# EAGLE design bpod_stepper_1.4.1 (EAGLE 9.6.2)
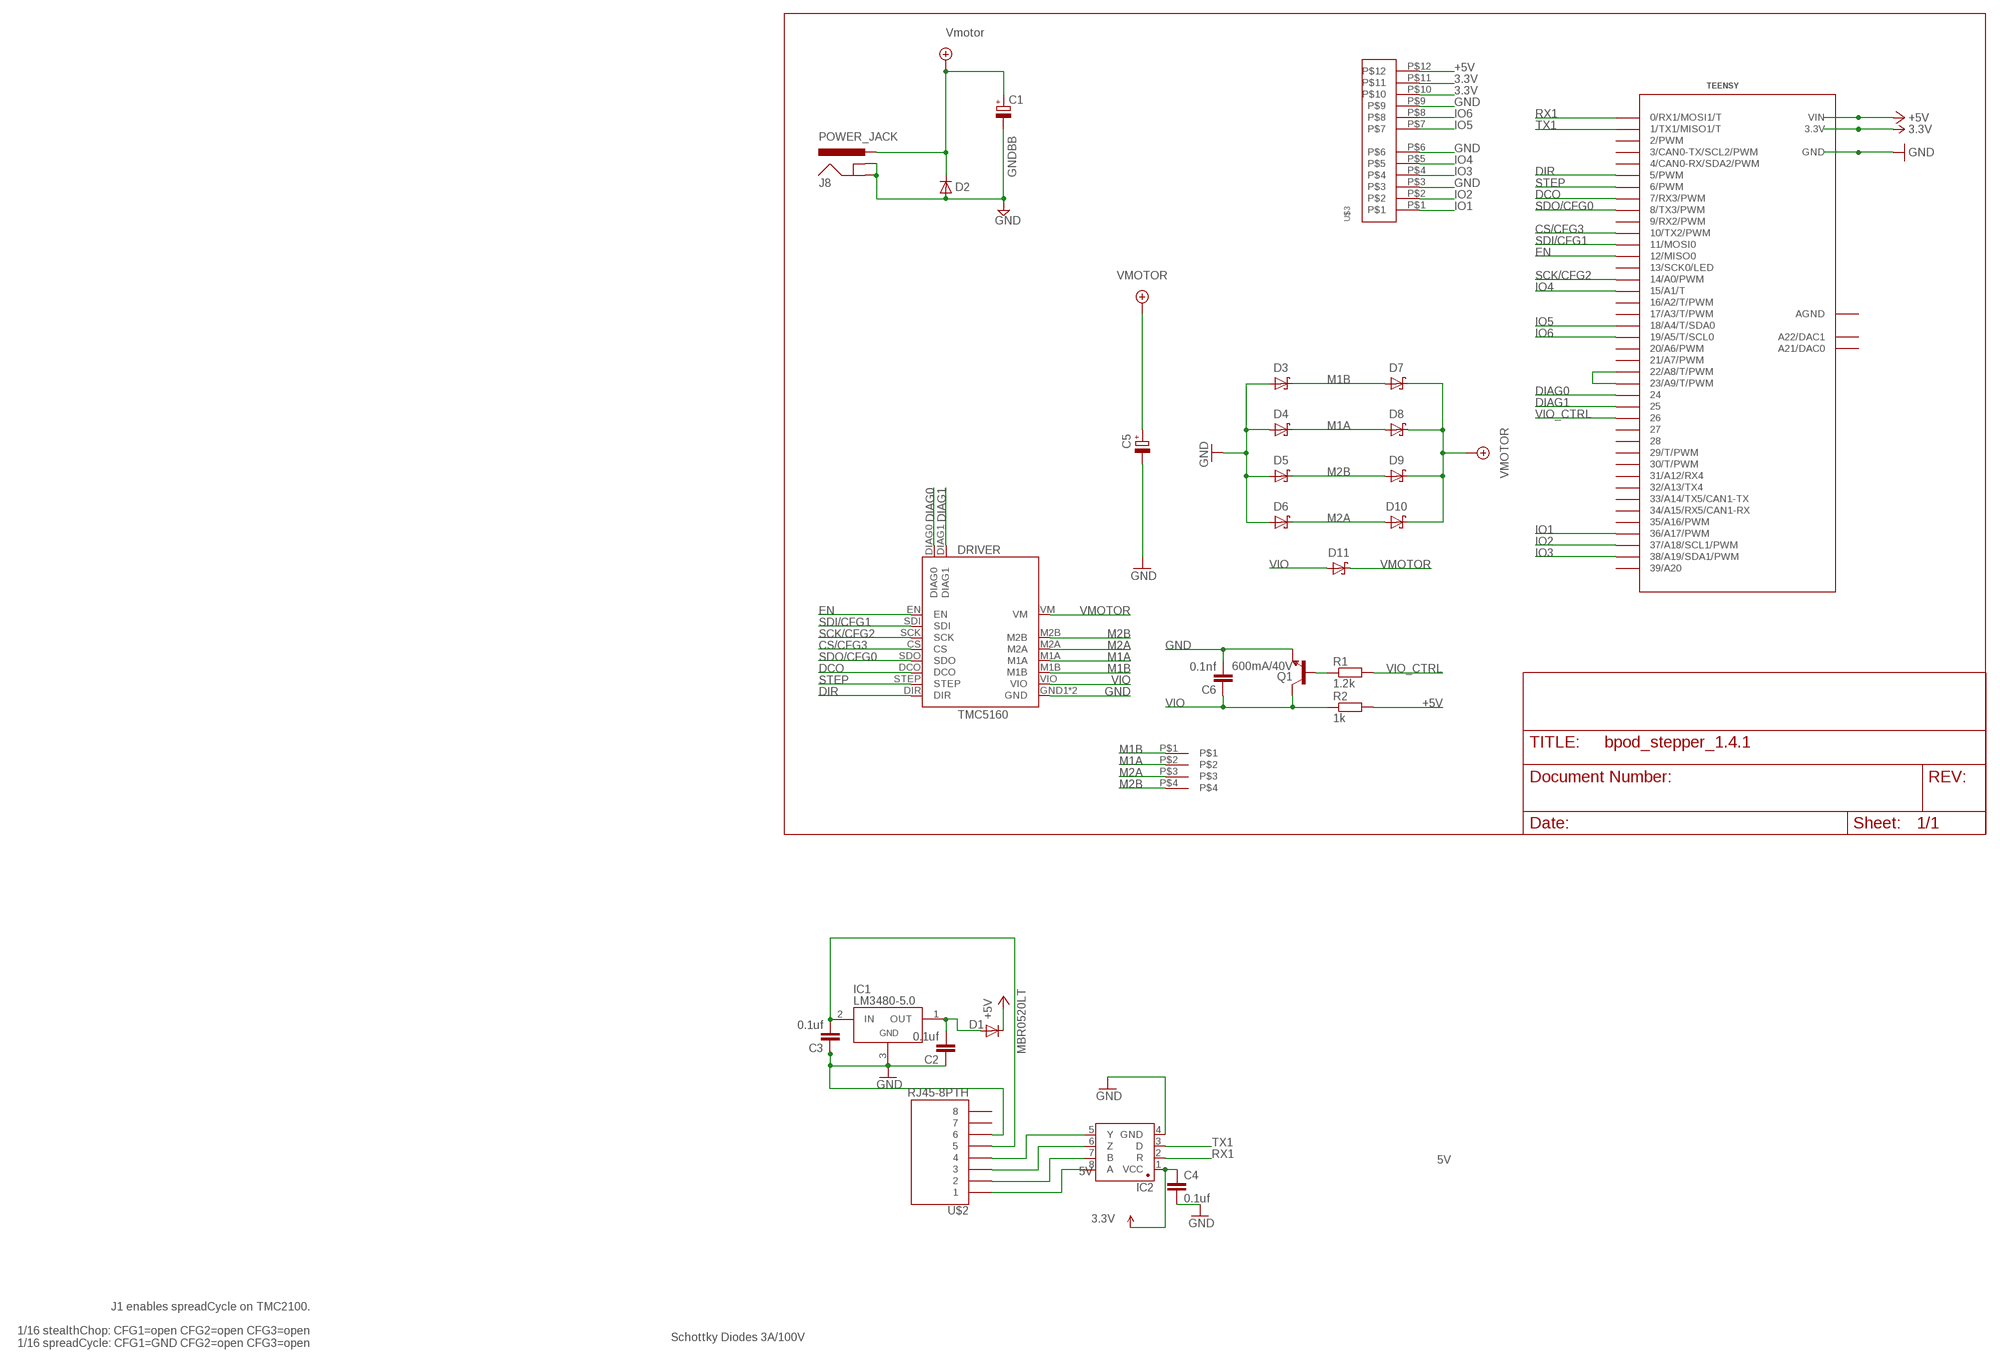
[diagram p0: schematic, sheet 1]

## Parts
C1  CPOL-EUG  [PANASONIC_G]
C2  0.1uf  CAP1206  [1206@1]
C3  0.1uf  CAP1206  [1206@1]
C4  0.1uf  CAP1206  [1206@1]
C5  CPOL-EUG  [PANASONIC_G]
C6  0.1nf  CAP1206  [1206@1]
D1  MBR0520LT  [SOD123]
D2  DIODE-DO214AA  [DO214AA]
D3  S310FA  D_SCHOTTKY-SOD123  [SOD123]
D4  S310FA  D_SCHOTTKY-SOD123  [SOD123]
D5  S310FA  D_SCHOTTKY-SOD123  [SOD123]
D6  S310FA  D_SCHOTTKY-SOD123  [SOD123]
D7  S310FA  D_SCHOTTKY-SOD123  [SOD123]
D8  S310FA  D_SCHOTTKY-SOD123  [SOD123]
D9  S310FA  D_SCHOTTKY-SOD123  [SOD123]
D10  S310FA  D_SCHOTTKY-SOD123  [SOD123]
D11  S310FA  D_SCHOTTKY-SOD123  [SOD123]
DRIVER  TMC5160  [TMC5160]
IC1  LM3480-5.0  [SOT-23-3]
IC2  SN65HVD31DR  [SO08]
J8  POWER_JACK  [POWER_JACK_PTH]
Q1  600mA/40V  TRANS_NPN-MMBT2222AL  [SOT23-3]
R1  1.2k  R-EU_R1206  [R1206]
R2  1k  R-EU_R1206  [R1206]
TEENSY  TEENSY_3.6_DIL  [TEENSY_3.6_DIL]
U$2  RJ45-8PTH  [RJ45-8]
U$3  12POS_MOLEX_SOCKET  [12POS_MOLEX_SOCKET]
U$4  MOLEX395221004  [MOLEX395221004]

## Nets
3.3V: C4.1 IC2.1(VCC) TEENSY.3.3V TEENSY.3.3V3(3.3V) U$3.P$10 U$3.P$11
+5V: D1.C R2.2 TEENSY.VIN U$3.P$12
CS/CFG3: DRIVER.CS TEENSY.10(10/TX2/PWM)
DCO: DRIVER.DCO TEENSY.7(7/RX3/PWM)
DIAG0: DRIVER.DIAG0 TEENSY.24
DIAG1: DRIVER.DIAG1 TEENSY.25
DIR: DRIVER.DIR TEENSY.5(5/PWM)
EN: DRIVER.EN TEENSY.12(12/MISO0)
GND: C1.- C2.1 C3.1 C4.2 C5.- C6.2 D2.A D3.A D4.A D5.A D6.A DRIVER.GND1(GND) DRIVER.GND2(GND) IC1.3(GND) IC2.4(GND) J8.GND J8.GNDBREAK Q1.2(E) TEENSY.GND TEENSY.GND1(GND) U$2.6 U$3.P$3 U$3.P$6 U$3.P$9
IO1: TEENSY.36/A17(36/A17/PWM) U$3.P$1
IO2: TEENSY.37/A18(37/A18/SCL1/PWM) U$3.P$2
IO3: TEENSY.38/A19(38/A19/SDA1/PWM) U$3.P$4
IO4: TEENSY.15/A1(15/A1/T) U$3.P$5
IO5: TEENSY.18/A4(18/A4/T/SDA0) U$3.P$7
IO6: TEENSY.19/A5(19/A5/T/SCL0) U$3.P$8
M1A: D4.C D8.A DRIVER.M1A U$4.P$2
M1B: D3.C D7.A DRIVER.M1B U$4.P$1
M2A: D6.C D10.A DRIVER.M2A U$4.P$3
M2B: D5.C D9.A DRIVER.M2B U$4.P$4
N$1: TEENSY.22/A8(22/A8/T/PWM) TEENSY.23/A9(23/A9/T/PWM)
N$6: Q1.1(B) R1.1
N$7: IC2.8(A) U$2.1
N$8: IC2.7(B) U$2.2
N$9: IC2.6(Z) U$2.3
N$10: IC2.5(Y) U$2.4
N$14: C2.2 D1.A IC1.1(OUT)
N$24: C3.2 IC1.2(IN) U$2.5
RX1: IC2.2(R) TEENSY.0(0/RX1/MOSI1/T)
SCK/CFG2: DRIVER.SCK TEENSY.14/A0(14/A0/PWM)
SDI/CFG1: DRIVER.SDI TEENSY.11(11/MOSI0)
SDO/CFG0: DRIVER.SDO TEENSY.8(8/TX3/PWM)
STEP: DRIVER.STEP TEENSY.6(6/PWM)
TX1: IC2.3(D) TEENSY.1(1/TX1/MISO1/T)
VIO: C6.1 D11.A DRIVER.VIO Q1.3(C) R2.1
VIO_CTRL: R1.2 TEENSY.26
VMOTOR: C1.+ C5.+ D2.C D7.C D8.C D9.C D10.C D11.C DRIVER.VM J8.PWR ; supply symbol labelled Vmotor
Unconnected: TEENSY.2(2/PWM) TEENSY.3(3/CAN0-TX/SCL2/PWM) TEENSY.4(4/CAN0-RX/SDA2/PWM) TEENSY.9(9/RX2/PWM) TEENSY.13(13/SCK0/LED) TEENSY.16/A2(16/A2/T/PWM) TEENSY.17/A3(17/A3/T/PWM) TEENSY.20/A6(20/A6/PWM) TEENSY.21/A7(21/A7/PWM) TEENSY.27 TEENSY.28 TEENSY.29(29/T/PWM) TEENSY.30(30/T/PWM) TEENSY.31/A12(31/A12/RX4) TEENSY.32/A13(32/A13/TX4) TEENSY.33/A14(33/A14/TX5/CAN1-TX) TEENSY.34/A15(34/A15/RX5/CAN1-RX) TEENSY.35/A16(35/A16/PWM) TEENSY.39/A20 TEENSY.A21(A21/DAC0) TEENSY.A22(A22/DAC1) U$2.7 U$2.8

## Notes on the sheet
- GNDBB
- 5V
- 5V
- J1 enables spreadCycle on TMC2100.
  
  1/16 stealthChop: CFG1=open CFG2=open CFG3=open
  1/16 spreadCycle: CFG1=GND CFG2=open CFG3=open
- Schottky Diodes 3A/100V

## Power pins joined to a net without a drawn wire
AGND: TEENSY.AGND

## Library data of the parts
C1 C5 = rcl:CPOL-EU: POLARIZED CAPACITOR, European symbol; SPICEPREFIX: C
C2-C4 C6 = SparkFun-Capacitors:CAP: Capacitor Standard 0603 ceramic capacitor, and 0.1" leaded capacitor.
D1 = diode:MBR0520LT: SCHOTTKY BARRIER RECTIFIER Source: http://onsemi.com .. MBR0520LT1-D.pdf
D2 = diode:DIODE-: DIODE
D3-D11 = we-rcl:D_SCHOTTKY: Schottky Diodes 1A, 30V - SOD323 (BAS3010 or CUS10S40) 2A, 30V - SMA/DO214AC 10A,45V - Z5-T (CDBZ5T1045)
DRIVER = TMC5160:TMC5160
IC1 = regulators:LM3480-*: National Semiconductor LM3480 100 mA, SOT-23, quasi-LDO linear regulator
IC2 = Joshparts4:SN65HVD31DR: A placeholder for generic narrow & wide SOIC8 foorptints - used on the DIP adapter board.
J8 = SparkFun-Connectors:POWER_JACK: Power Jack Connector This is the standard 5.5mm barrel jack for power. The PTH is the most common, proven, reliable, footprint. The Slot footprint only works if the mill layer is transmitted to the PCB fab house so be warned. Here are the connectors we sell at SparkFun: DC Barrel Power Jack/Connector <https://www.sparkfun.com/products/119> (PRT-00119) DC Barrel Power Jack/Connector (SMD) <https://www.sparkfun.com/products/12748> (PRT-12748) DC Barrel Jack Adapter - Breadboard Compatible <https://www.sparkfun.com/products/10811> (PRT-10811) It is used on this SparkFun product (and many, many others): SparkFun RedBoard - Programmed with Arduino <https://www.sparkfun.com/products/12757> (DEV-12757) Also, if you need a mating power supply or connector, please check these out: Wall Adapter Power Supply - 9VDC 650mA <https://www.sparkfun.com/products/298> (TOL-00298) DC Barrel Jack Adapter - Male <https://www.sparkfun.com/products/10287> (PRT-10287); PROD_ID: CONN-08197
Q1 = SparkFun-DiscreteSemi:TRANS_NPN: NPN transistor Current controlled devices typically used to amplify current or used as a switch. BC547 - COM-08928 <http://www.sparkfun.com/products/8928> (TO-92 45V 100mA) (1.Collector 2.Base 3.Emitter) 2N3904 - COM-00521 <http://www.sparkfun.com/products/521> (TO-92 40V 200mA) (1.Emitter 2.Base 3.Collector) P2N2222A - COM-12852 <http://www.sparkfun.com/products/12852> (TO-92 40V 600mA) (1.Collector 2.Base 3.Emitter); PROD_ID: TRANS-08049
R1 R2 = rcl:R-EU_: RESISTOR, European symbol; SPICEPREFIX: R
TEENSY = Teensy_3_and_LC_Series_Boards_v1.4:TEENSY_3.6_DIL: Teensy 3.6 DIL Package
U$2 = SparkFun:RJ45-8: RJ45 Jack Simple RJ45, 8-pin connection - connector for common Cat5, Cat5e, and Cat6 Ethernet cables. Footprint not yet proven in production. Connector sku is PRT-00643; Breakout PCB sku is BOB-00716.
U$3 = JoshParts10:12POS_MOLEX_SOCKET
U$4 = flo:MOLEX395221004

## Board
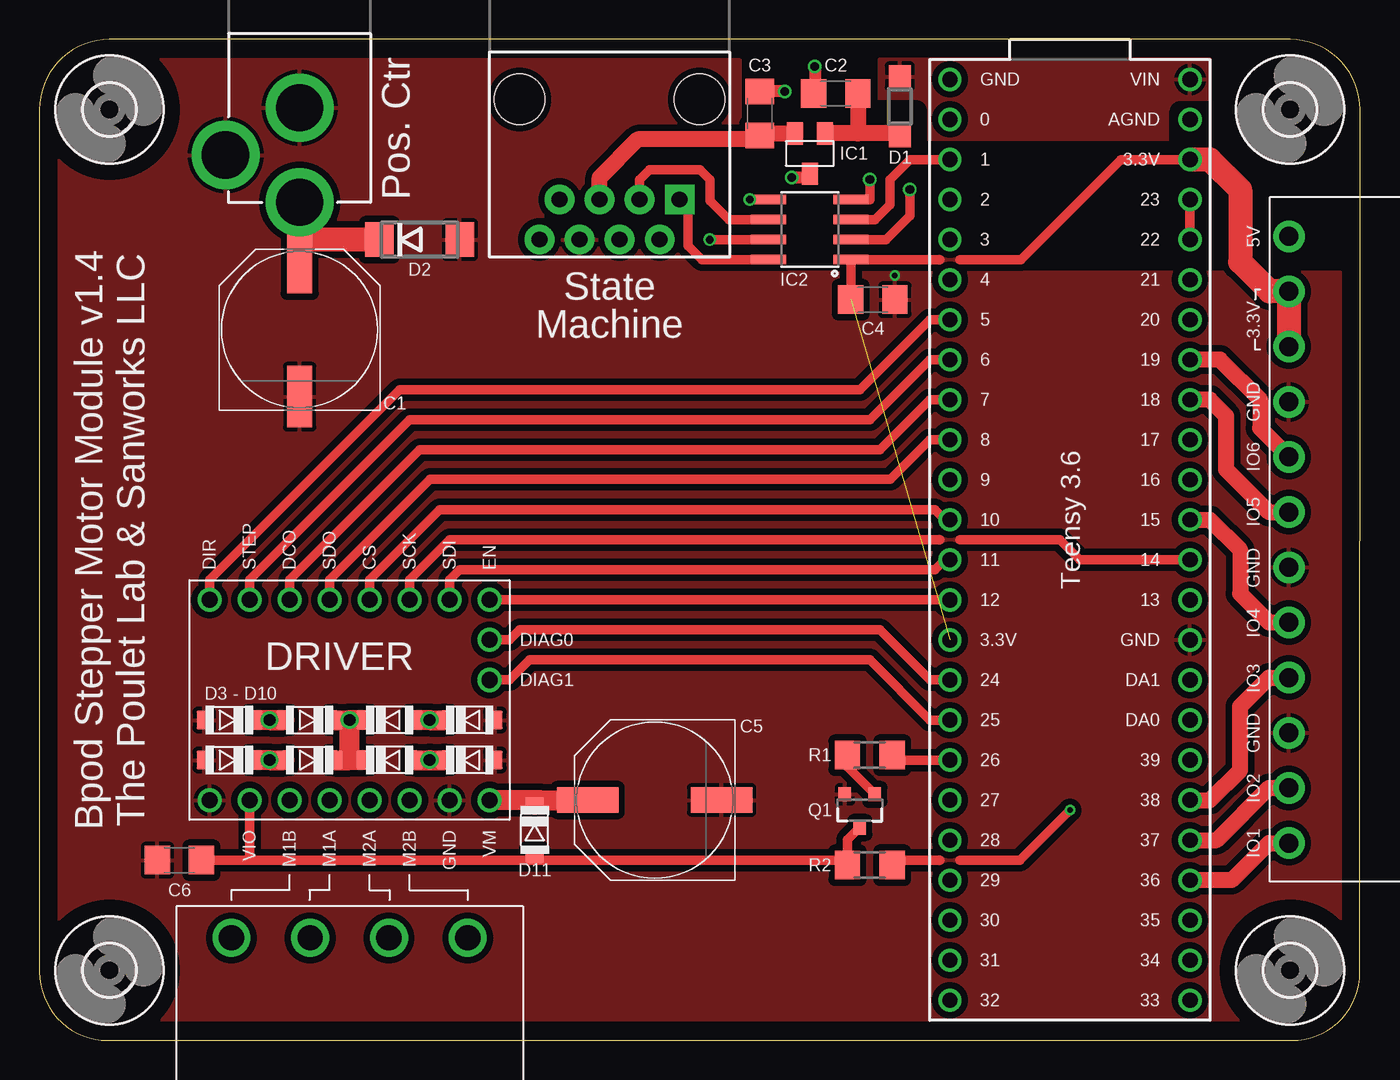
[diagram p1: board, top side]
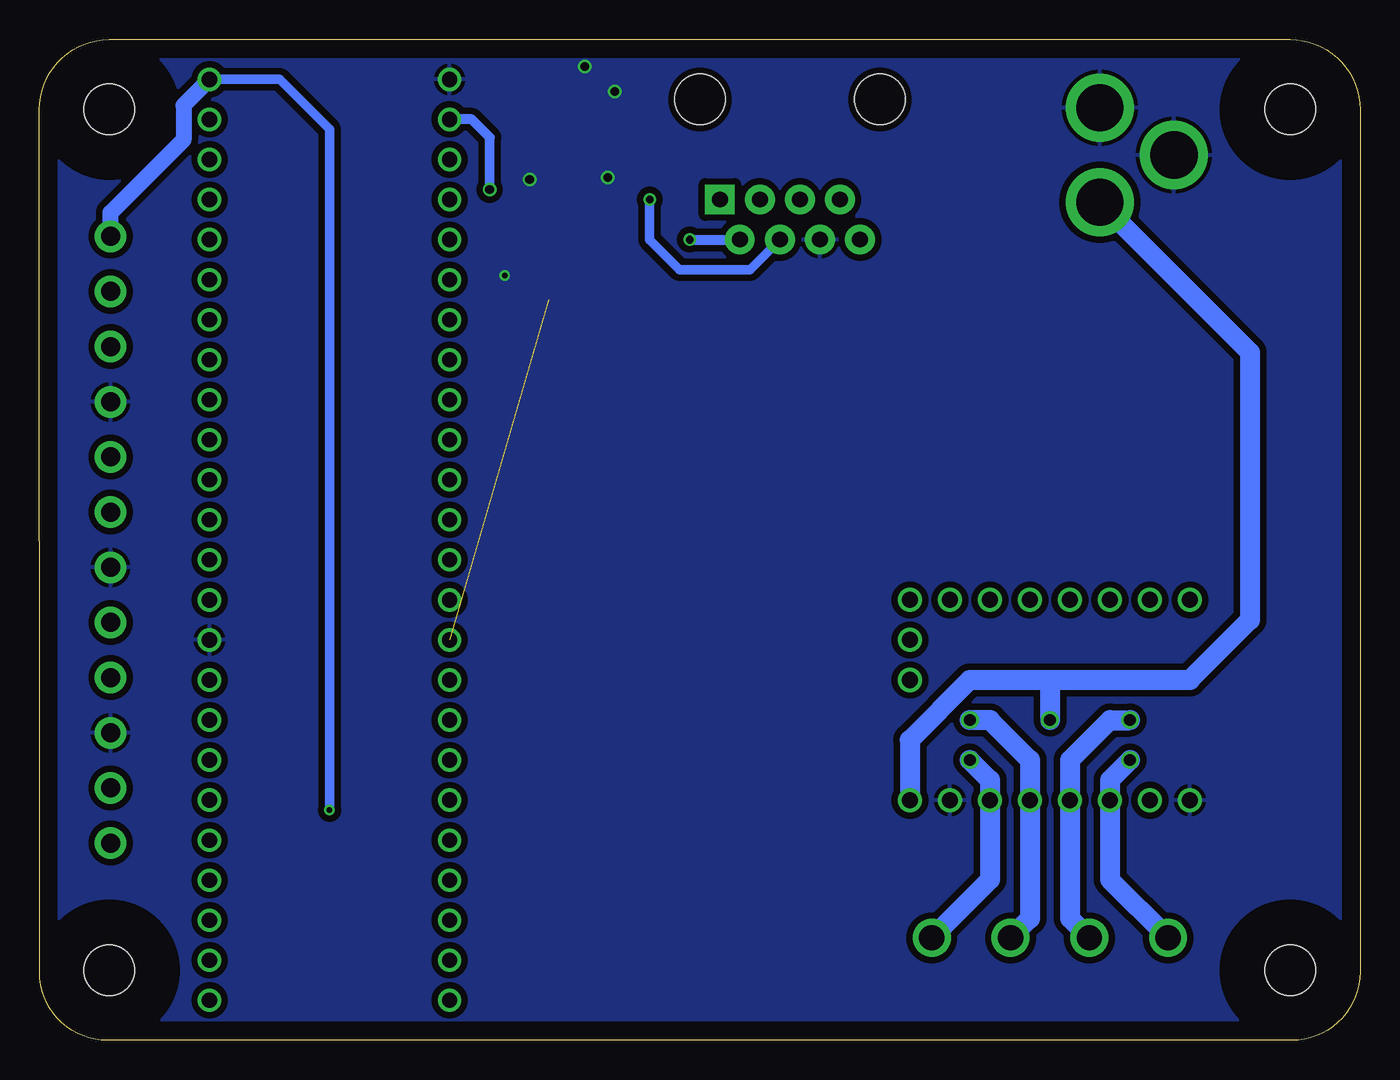
[diagram p2: board, bottom side, seen from below]

Size 83.82 x 63.5 mm. Coordinates in mm from the lower left corner, seen from the top.
Outline: 79.38,63.5 4.45,63.5 arc90 0,59.05 0,4.34 arc90 4.34,0 79.5,0 arc90 83.8,4.3 83.82,59.05 arc90 79.38,63.5
Copper layers (1*16): Top 0.035mm / dielectric 1.5mm / Bottom 0.035mm
Design rules "SeeedStudio_2layer_DRU_no_angle_20140221 *": minimum track width 6mil, minimum drill 12mil, track to track 12mil, track to pad 12mil, pad to pad 12mil, via to via 12mil, smd to smd 0mil, copper to edge 10mil, drill to drill 10mil, minimum pad ring 10mil, minimum via ring 6mil, stop-mask expansion 2mil, vias tented up to drill 100mil, thermal gap 10mil
tRestrict: area 72.4,57.1 to 74.9,58.9; area 32.8,51.9 to 35.8,52.2; area 53.3,57.1 to 55.6,58.9
bRestrict: area 32.8,51.9 to 35.8,52.2

### Footprints (pad centres in the part's own frame; a part is rotated, then mirrored left to right if it is on the bottom)
PANASONIC_G = smd 3.9 x 1.6: + 4.25,0; - -4.25,0
1206@1 = smd 1.6 x 1.8: 1 -1.4,0; 2 1.4,0
SOD123 = smd 1.4 x 1.4: A 1.9,0; C -1.9,0
DO214AA = smd 1.8 x 2.2: A 2.55,0; C -2.55,0
SOD123' = smd 1.2 x 1: A 0,-1.6; C 0,1.6
TMC5160 = drill 1.016: CS -6.35,1.27; DCO -6.35,-3.81; DIAG0 -3.81,8.89; DIAG1 -1.27,8.89; DIR -6.35,-8.89; EN -6.35,8.89; GND1 6.35,6.35; GND2 6.35,-8.89; M1A 6.35,-1.27; M1B 6.35,-3.81; M2A 6.35,1.27; M2B 6.35,3.81; SCK -6.35,3.81; SDI -6.35,6.35; SDO -6.35,-1.27; STEP -6.35,-6.35; VIO 6.35,-6.35; VM 6.35,8.89
SOT-23-3 = smd 1.016 x 1.397: 1 -0.953,-1.27; 2 0.953,-1.27; 3 0,1.27
SO08 = smd 0.61 x 2.21: 1 -1.905,-2.616; 2 -0.635,-2.616; 3 0.635,-2.616; 4 1.905,-2.616; 5 1.905,2.616; 6 0.635,2.616; 7 -0.635,2.616; 8 -1.905,2.616
POWER_JACK_PTH = drill 2.997 pad 4.318: GND 0,7.7; GNDBREAK 4.7,10.7; PWR 0,13.7
SOT23-3 = smd 0.8 x 0.9: 1 -0.95,-1; 2 0.95,-1; 3 0,1.1
R1206 = smd 1.6 x 1.803: 1 -1.422,0; 2 1.422,0
TEENSY_3.6_DIL = drill 0.965: 0 -7.62,25.4; 1 -7.62,22.86; 2 -7.62,20.32; 3 -7.62,17.78; 3.3V 7.62,22.86; 3.3V3 -7.62,-7.62; 4 -7.62,15.24; 5 -7.62,12.7; 6 -7.62,10.16; 7 -7.62,7.62; 8 -7.62,5.08; 9 -7.62,2.54; 10 -7.62,0; 11 -7.62,-2.54; 12 -7.62,-5.08; 13 7.62,-5.08; 14/A0 7.62,-2.54; 15/A1 7.62,0; 16/A2 7.62,2.54; 17/A3 7.62,5.08; 18/A4 7.62,7.62; 19/A5 7.62,10.16; 20/A6 7.62,12.7; 21/A7 7.62,15.24; 22/A8 7.62,17.78; 23/A9 7.62,20.32; 24 -7.62,-10.16; 25 -7.62,-12.7; 26 -7.62,-15.24; 27 -7.62,-17.78; 28 -7.62,-20.32; 29 -7.62,-22.86; 30 -7.62,-25.4; 31/A12 -7.62,-27.94; 32/A13 -7.62,-30.48; 33/A14 7.62,-30.48; 34/A15 7.62,-27.94; 35/A16 7.62,-25.4; 36/A17 7.62,-22.86; 37/A18 7.62,-20.32; 38/A19 7.62,-17.78; 39/A20 7.62,-15.24; A21 7.62,-12.7; A22 7.62,-10.16; AGND 7.62,25.4; GND -7.62,27.94; GND1 7.62,-7.62; VIN 7.62,27.94
RJ45-8 = drill 1 pad 1.88 square: 1 -4.445,6.35 | drill 1 pad 1.88: 2 -3.175,8.89; 3 -1.905,6.35; 4 -0.635,8.89; 5 0.635,6.35; 6 1.905,8.89; 7 3.175,6.35; 8 4.445,8.89 | hole 3.2: -5.715,0; 5.715,0
12POS_MOLEX_SOCKET = drill 1.2 pad 2: P$1 -19.239,0.706; P$2 -15.739,0.706; P$3 -12.239,0.706; P$4 -8.739,0.706; P$5 -5.239,0.706; P$6 -1.739,0.706; P$7 1.761,0.706; P$8 5.261,0.706; P$9 8.761,0.706; P$10 12.261,0.706; P$11 15.761,0.706; P$12 19.261,0.706
MOLEX395221004 = drill 1.6: P$1 -7.5,0; P$2 -2.5,0; P$3 2.5,0; P$4 7.5,0
3,2 = hole 3.2: 0,0

### Placement (x,y rotation side)
C1  16.51,45.09 90 top
C2  50.55,60.07 0 top
C3  45.72,58.8 270 top
C4  52.9,46.99 0 top
C5  39.05,15.24 180 top
C6  8.89,11.43 180 top
D1  54.61,59.25 270 top
D2  24.13,50.8 0 top
D3  S310FA  [SOD123']  12.06,17.78 270 top
D4  S310FA  [SOD123']  12.06,20.32 270 top
D5  S310FA  [SOD123']  27.3,17.78 90 top
D6  S310FA  [SOD123']  27.3,20.32 90 top
D7  S310FA  [SOD123']  17.14,17.78 270 top
D8  S310FA  [SOD123']  17.14,20.32 270 top
D9  S310FA  [SOD123']  22.23,17.78 90 top
D10  S310FA  [SOD123']  22.23,20.32 90 top
D11  S310FA  [SOD123']  31.43,13.34 0 top
DRIVER  19.68,21.59 270 top
IC1  48.9,56.26 180 top
IC2  48.9,51.44 90 top
J8  16.51,66.87 180 top
Q1  52.07,14.61 180 top
R1  52.7,18.1 0 top
R2  52.7,11.11 0 top
TEENSY  65.41,33.02 0 top
U$2  36.19,59.69 180 top
U$3  80,31.75 90 top
U$4  19.68,6.5 0 top
U$7  [3,2]  4.45,4.45 0 top
U$8  [3,2]  4.45,59.05 0 top
U$9  [3,2]  79.38,59.05 0 top
U$10  [3,2]  79.38,4.45 0 top

### Tracks (layer width: path | path; a pad name or v marks a point on that pad's centre or on a via)
3.3V  (1 unrouted)
  Top 0.61: IC2.1 52.07,49.53 | IC2.1 57.15,49.53 | C4.1 51.49,49.51 IC2.1 | 58.42,49.53 62.29,49.53 68.64,55.88 TEENSY.3.3V
  Top 1.524: TEENSY.3.3V 74.3,55.88 76.2,53.98 76.2,49.38 78.07,47.51 U$3.P$11 U$3.P$10
  pour Top (isolate 0.406): 57.15,49.21 57.15,49.85 58.42,49.85 58.42,49.21
+5V  (via drill 0.35)
  Top 0.61: 57.15,11.43 54.44,11.43 R2.2 | v65.41,14.61 62.23,11.43 58.42,11.43
  Bottom 0.61: TEENSY.VIN 68.58,60.96 65.41,57.78 v65.41,14.61
  Bottom 1.016: U$3.P$12 79.29,52.51 74.68,57.13 74.68,59.31 TEENSY.VIN
  pour Top (isolate 0.406): 74.3,62.23 74.3,57.15 53.34,57.15 53.34,62.23
  pour Top (isolate 0.406): 58.42,11.11 57.15,11.11 57.15,11.75 58.42,11.75
CS/CFG3
  Top 0.61: DRIVER.CS 20.95,29.21 25.4,33.66 56.83,33.66 57.47,33.02 TEENSY.10
DCO
  Top 0.61: DRIVER.DCO 15.88,29.21 24.13,37.47 53.34,37.47 56.52,40.64 TEENSY.7
DIAG0
  Top 0.61: TEENSY.24 56.52,22.86 53.34,26.04 30.48,26.04 29.84,25.4 DRIVER.DIAG0
DIAG1
  Top 0.61: TEENSY.25 57.15,20.32 56.52,20.32 52.7,24.13 31.11,24.13 29.84,22.86 DRIVER.DIAG1
DIR
  Top 0.61: DRIVER.DIR 10.79,29.21 22.86,41.27 52.07,41.27 56.52,45.72 TEENSY.5
EN
  Top 0.61: TEENSY.12 DRIVER.EN
GND  (via drill 0.35, 0.55)
  Top 0.61: C3.1 | IC2.4 52.7,53.34 v52.7,54.61
  Top 0.762: v47.31,60.2 C3.1 | IC1.3 48.64,54.74 v47.75,54.74 | C2.1 49.02,60.2 49.21,60.39 v49.21,61.78
  other vias: 54.29,48.51
  pour Bottom (isolate 0.406): 82.55,62.23 1.27,62.23 1.27,1.27 82.55,1.27
  pour Top (isolate 0.406, rank 2): 82.55,1.27 1.27,1.27 1.27,62.23 44.45,62.23 44.45,48.77 82.55,48.77
IO1
  Top 1.016: U$3.P$1 78.02,12.51 75.67,10.16 TEENSY.36/A17
IO2
  Top 1.016: TEENSY.37/A18 74.71,12.7 78.02,16.01 U$3.P$2
IO3
  Top 1.016: TEENSY.38/A19 74.3,15.24 76.2,17.14 76.2,21.19 78.02,23.01 U$3.P$4
IO4
  Top 1.016: U$3.P$5 78.02,26.51 76.2,28.34 76.2,31.11 74.3,33.02 TEENSY.15/A1
IO5
  Top 1.016: U$3.P$7 78.02,33.51 75.31,36.22 75.31,39.62 74.3,40.64 TEENSY.18/A4
IO6
  Top 1.016: U$3.P$8 77.47,38.84 77.47,40.64 74.93,43.18 TEENSY.19/A5
M1A  (via drill 0.75)
  Top 1.27: v14.61,20.32 D8.A D4.C
  Bottom 1.27: U$4.P$2 18.41,7.73 DRIVER.M1A 18.41,17.78 15.88,20.32 v14.61,20.32
M1B  (via drill 0.75)
  Top 1.27: D3.C v14.61,17.78 D7.A
  Bottom 1.27: U$4.P$1 15.88,10.19 DRIVER.M1B 15.88,16.51 v14.61,17.78
M2A  (via drill 0.75)
  Top 1.27: D10.A v24.77,20.32 D6.C
  Bottom 1.27: U$4.P$3 20.95,7.73 DRIVER.M2A 20.95,17.78 23.5,20.32 v24.77,20.32
M2B  (via drill 0.75)
  Top 1.27: D9.A v24.77,17.78 D5.C
  Bottom 1.27: U$4.P$4 23.5,10.19 DRIVER.M2B 23.5,16.51 v24.77,17.78
N$1
  Top 0.61: TEENSY.23/A9 TEENSY.22/A8
N$6
  Top 0.61: Q1.1 51.28,17.34 R1.1
N$7
  Top 0.61: IC2.8 42.04,49.53 41.15,50.42 41.15,53.34 U$2.1
N$8  (via drill 0.5)
  Top 0.61: v42.55,50.8 IC2.7
  Bottom 0.635: v42.55,50.8 U$2.2
N$9
  Top 0.61: IC2.6 43.75,52.07 42.55,53.28 42.55,54.61 41.91,55.24 38.73,55.24 38.09,54.6 U$2.3
N$10  (via drill 0.5)
  Top 0.61: IC2.5 v45.09,53.34
  Bottom 0.61: v45.09,53.34 45.09,50.8 43.18,48.9 38.73,48.9 U$2.4
N$14
  Top 1.016: D1.A 54.42,57.53 51.95,57.53 | 51.95,57.53 IC1.1 | C2.2 51.95,57.53
N$24
  Top 0.61: 45.85,57.15 45.85,57.27 C3.2 45.72,57.53
  Top 1.016: U$2.5 35.55,54.74 37.96,57.15 45.85,57.15 | 45.72,57.53 IC1.2
RX1  (via drill 0.55)
  Top 0.61: IC2.2 53.72,50.8 55.24,52.32 v55.24,53.98
  Bottom 0.61: 55.24,57.28 v55.24,53.98
  Bottom 0.635: TEENSY.0 56.39,58.42 55.24,57.28
SCK/CFG2
  Top 0.61: DRIVER.SCK 23.5,29.21 26.04,31.75 57.15,31.75 | TEENSY.14/A0 66.04,30.48 64.77,31.75 58.42,31.75
  pour Top (isolate 0.406): 57.15,31.43 57.15,32.07 58.42,32.07 58.42,31.43
SDI/CFG1
  Top 0.61: DRIVER.SDI 26.04,29.21 26.67,29.84 56.83,29.84 57.47,30.48 TEENSY.11
SDO/CFG0
  Top 0.61: DRIVER.SDO 18.41,29.21 24.8,35.6 54.01,35.6 56.52,38.1 TEENSY.8
STEP
  Top 0.61: DRIVER.STEP 13.34,29.21 23.5,39.37 52.7,39.37 56.52,43.18 TEENSY.6
TX1
  Top 0.61: IC2.3 53.02,52.07 53.98,53.02 53.98,54.61 55.24,55.88 TEENSY.1
VIO
  Top 0.61: Q1.3 51.28,12.72 R2.1 50.97,11.43 31.43,11.43 | DRIVER.VIO 13.34,11.43 C6.1 31.43,11.43 | D11.A 31.43,11.43
VIO_CTRL
  Top 0.61: TEENSY.26 54.13,17.78 R1.2
VMOTOR  (via drill 0.75)
  Top 0.61: 31.74,15.24 31.75,15.24
  Top 1.27: 19.68,17.78 v19.68,20.32 | D8.C v19.68,20.32 | D7.C 19.68,17.78 | D9.C 19.68,17.78 | D10.C v19.68,20.32 | 31.75,15.24 DRIVER.VM | D11.C 31.74,15.24 C5.+
  Top 1.524: J8.PWR C1.+ 16.51,50.8 D2.C
  Bottom 1.27: J8.PWR 6.99,43.64 6.99,26.67 10.79,22.86 19.68,22.86 | DRIVER.VM 28.57,19.05 24.77,22.86 19.68,22.86 | 19.68,22.86 v19.68,20.32

### Text on the board
tPlace: Pos. Ctr | State | Machine
tNames: GND | VIN | 0 | AGND | 1 | 3.3V | 2 | 23 | 3 | 22 | 5V | 4 | 21 | 5 | 20 | 3.3V | 6 | 19 | 7 | 18 | GND | 8 | 17 | IO6 | 9 | 16 | IO5 | 10 | Teensy 3.6 | 15 | Bpod Stepper Motor Module v1.4 / The Poulet Lab & Sanworks LLC | 11 | 14 | GND | 12 | 13 | IO4 | 3.3V | GND | 24 | DA1 | IO3 | D3 - D10 | 25 | DA0 | GND | 26 | 39 | IO2 | 27 | 38 | 28 | 37 | IO1 | 29 | 36 | 30 | 35 | 31 | 34 | 32 | 33